# EAGLE design open-bldc-powermini (EAGLE 5.06)
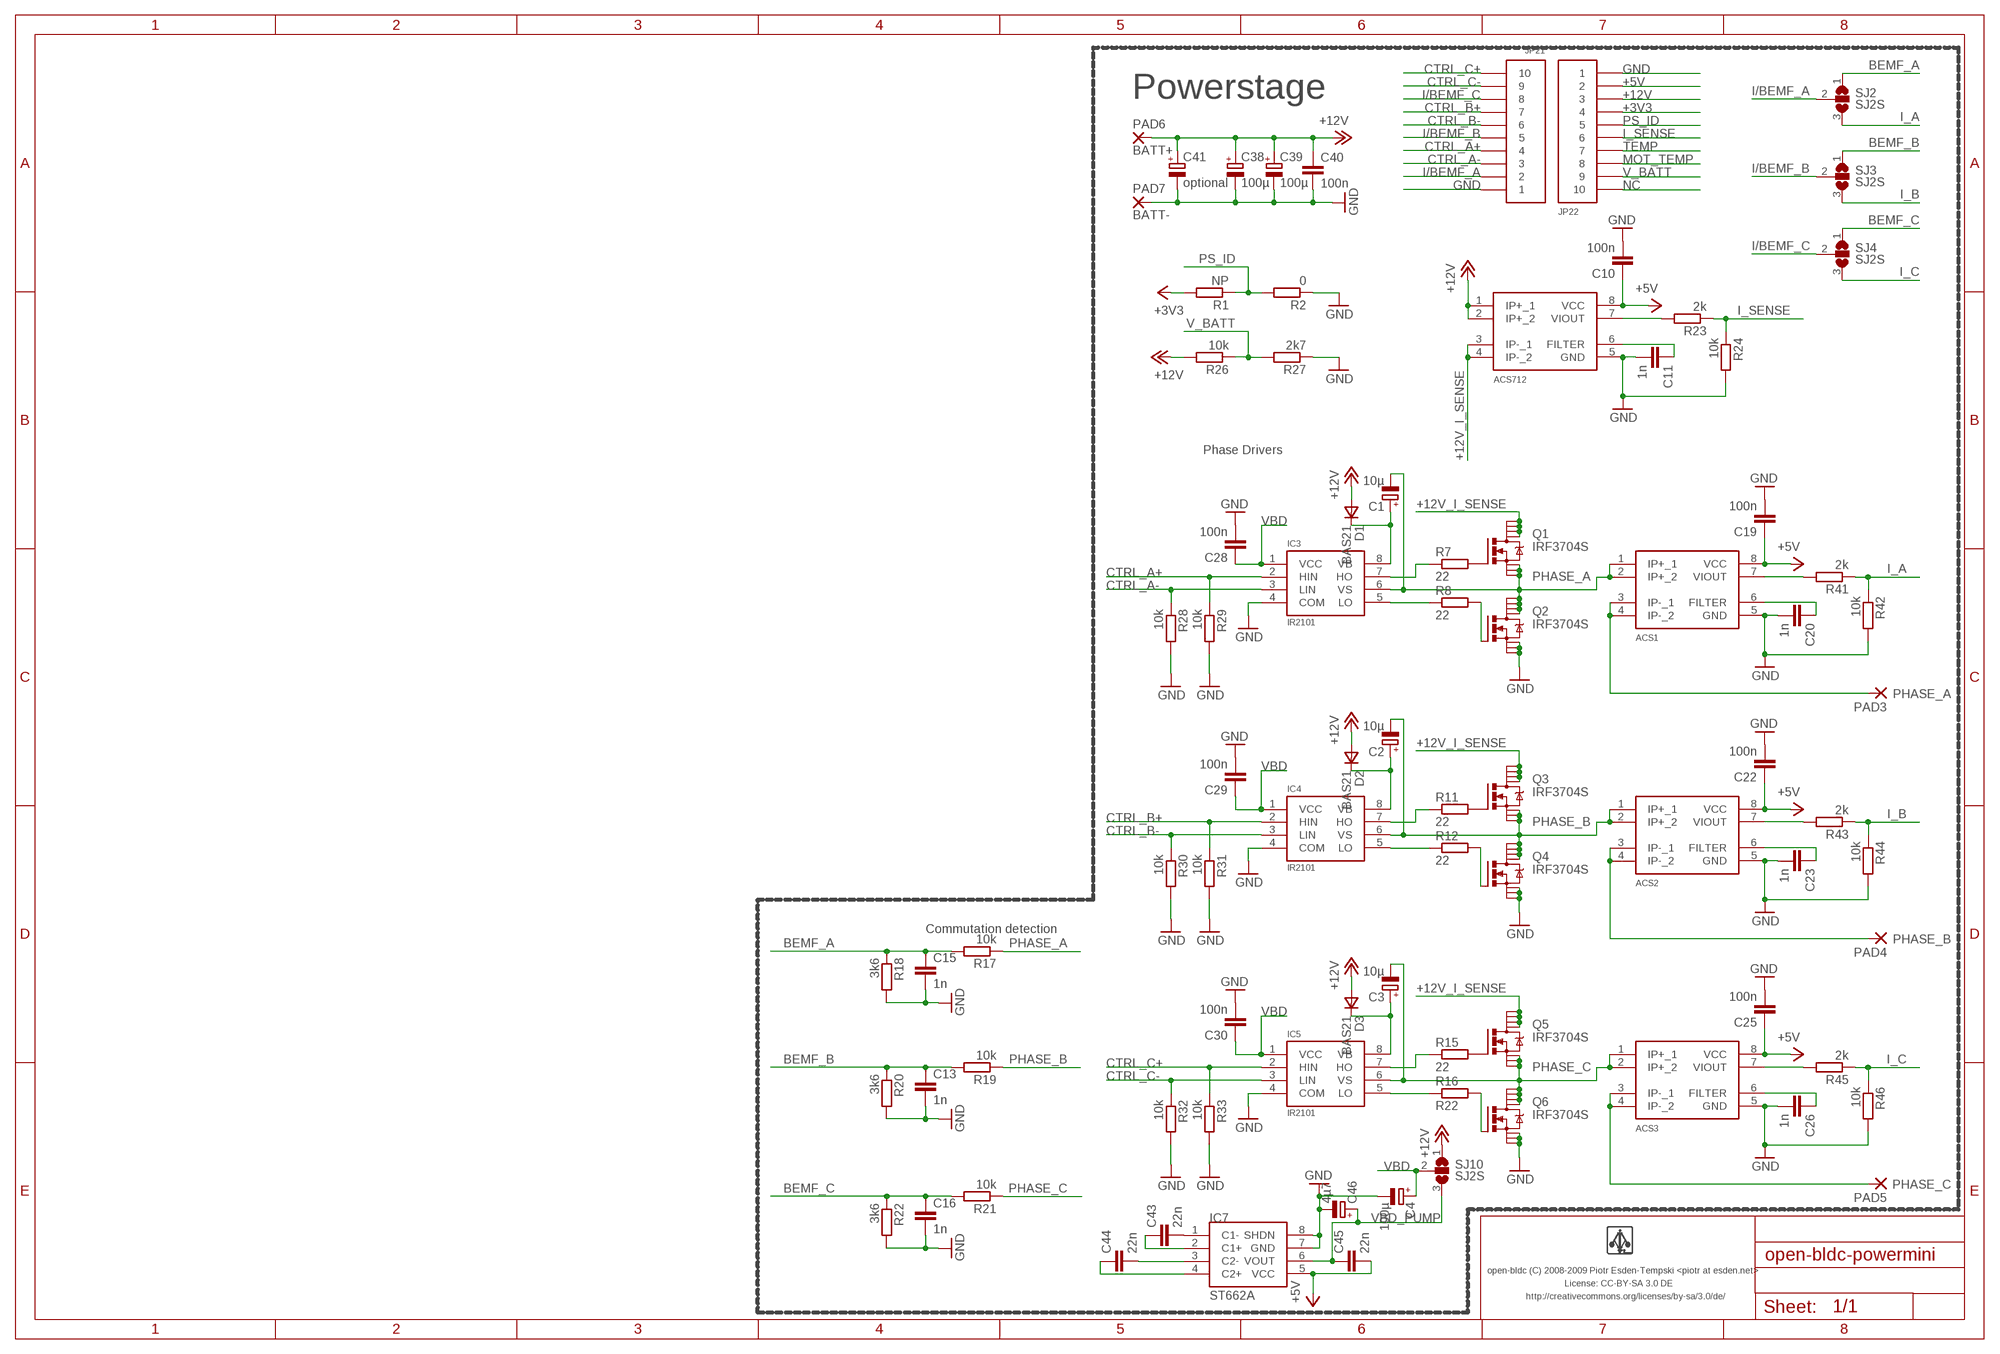
[diagram p0: schematic, sheet 1]

## Parts
ACS1  ACS712  [SO8]
ACS2  ACS712  [SO8]
ACS3  ACS712  [SO8]
ACS712  ACS712  [SO8]
C1  10µ  CPOL-EUA/3216-18R  [A/3216-18R]
C2  10µ  CPOL-EUA/3216-18R  [A/3216-18R]
C3  10µ  CPOL-EUA/3216-18R  [A/3216-18R]
C4  100µ  CPOL-EUD/7343-31R  [D/7343-31R]
C10  100n  C-EUC0603  [C0603]
C11  1n  C-EUC0603  [C0603]
C13  1n  C-EUC0603  [C0603]
C15  1n  C-EUC0603  [C0603]
C16  1n  C-EUC0603  [C0603]
C19  100n  C-EUC0603  [C0603]
C20  1n  C-EUC0603  [C0603]
C22  100n  C-EUC0603  [C0603]
C23  1n  C-EUC0603  [C0603]
C25  100n  C-EUC0603  [C0603]
C26  1n  C-EUC0603  [C0603]
C28  100n  C-EUC0603  [C0603]
C29  100n  C-EUC0603  [C0603]
C30  100n  C-EUC0603  [C0603]
C38  100µ  CPOL-EUD/7343-31R  [D/7343-31R]
C39  100µ  CPOL-EUD/7343-31R  [D/7343-31R]
C40  100n  C-EUC0603  [C0603]
C41  optional  CPOL-EUE5-6  [E5-6]
C43  22n  C-EUC0603  [C0603]
C44  22n  C-EUC0603  [C0603]
C45  22n  C-EUC0603  [C0603]
C46  4µ7  CPOL-EUA/3216-18R  [A/3216-18R]
D1  BAS21  VAR2SOT23  [SOT-23]
D2  BAS21  VAR2SOT23  [SOT-23]
D3  BAS21  VAR2SOT23  [SOT-23]
IC3  IR2101  [SO-8]
IC4  IR2101  [SO-8]
IC5  IR2101  [SO-8]
IC7  ST662A  [SO8]
JP21  PIN_HDR_1.27MM_10  PIN_HDR_1.27MM_10_SMT  [PIN_HDR_1.27MM_SMD_10]
JP22  PIN_HDR_1.27MM_10  PIN_HDR_1.27MM_10_SMT  [PIN_HDR_1.27MM_SMD_10]
PAD3  PHASE_A  SMD5  [SMD2,54-5,08]
PAD4  PHASE_B  SMD5  [SMD2,54-5,08]
PAD5  PHASE_C  SMD5  [SMD2,54-5,08]
PAD6  BATT+  SMD5  [SMD2,54-5,08]
PAD7  BATT-  SMD5  [SMD2,54-5,08]
Q1  IRF3704S  N-MOSFET-SO8S  [SO-08]
Q2  IRF3704S  N-MOSFET-SO8S  [SO-08]
Q3  IRF3704S  N-MOSFET-SO8S  [SO-08]
Q4  IRF3704S  N-MOSFET-SO8S  [SO-08]
Q5  IRF3704S  N-MOSFET-SO8S  [SO-08]
Q6  IRF3704S  N-MOSFET-SO8S  [SO-08]
R1  NP  R-EU_R0603  [R0603]
R2  0  R-EU_R0603  [R0603]
R7  22  R-EU_R0603  [R0603]
R8  22  R-EU_R0603  [R0603]
R11  22  R-EU_R0603  [R0603]
R12  22  R-EU_R0603  [R0603]
R15  22  R-EU_R0603  [R0603]
R16  R22  R-EU_R0603  [R0603]
R17  10k  R-EU_R0603  [R0603]
R18  3k6  R-EU_R0603  [R0603]
R19  10k  R-EU_R0603  [R0603]
R20  3k6  R-EU_R0603  [R0603]
R21  10k  R-EU_R0603  [R0603]
R22  3k6  R-EU_R0603  [R0603]
R23  2k  R-EU_R0603  [R0603]
R24  10k  R-EU_R0603  [R0603]
R26  10k  R-EU_R0603  [R0603]
R27  2k7  R-EU_R0603  [R0603]
R28  10k  R-EU_R0603  [R0603]
R29  10k  R-EU_R0603  [R0603]
R30  10k  R-EU_R0603  [R0603]
R31  10k  R-EU_R0603  [R0603]
R32  10k  R-EU_R0603  [R0603]
R33  10k  R-EU_R0603  [R0603]
R41  2k  R-EU_R0603  [R0603]
R42  10k  R-EU_R0603  [R0603]
R43  2k  R-EU_R0603  [R0603]
R44  10k  R-EU_R0603  [R0603]
R45  2k  R-EU_R0603  [R0603]
R46  10k  R-EU_R0603  [R0603]
SJ2  SJ2S  [SJ2S]
SJ3  SJ2S  [SJ2S]
SJ4  SJ2S  [SJ2S]
SJ10  SJ2S  [SJ2S]

## Nets
+3V3: JP22.4 R1.2
+5V: ACS1.8(VCC) ACS2.8(VCC) ACS3.8(VCC) ACS712.8(VCC) C10.1 C19.1 C22.1 C25.1 C45.2 IC7.5(VCC) JP22.2
+12V: ACS712.1(IP+_1) ACS712.2(IP+_2) C38.+ C39.+ C40.1 C41.+ D1.3(A) D2.3(A) D3.3(A) JP22.3 PAD6.1(P) R26.2 SJ10.1
+12V_I_SENSE: ACS712.3(IP-_1) ACS712.4(IP-_2) Q1.5(D) Q1.6(D) Q1.7(D) Q1.8(D) Q3.5(D) Q3.6(D) Q3.7(D) Q3.8(D) Q5.5(D) Q5.6(D) Q5.7(D) Q5.8(D)
BEMF_A: C15.1 R17.2 R18.1 SJ2.1
BEMF_B: C13.1 R19.2 R20.1 SJ3.1
BEMF_C: C16.1 R21.2 R22.1 SJ4.1
CTRL_A+: IC3.2(HIN) JP21.4 R29.1
CTRL_A-: IC3.3(LIN) JP21.3 R28.1
CTRL_B+: IC4.2(HIN) JP21.7 R31.1
CTRL_B-: IC4.3(LIN) JP21.6 R30.1
CTRL_C+: IC5.2(HIN) JP21.10 R33.1
CTRL_C-: IC5.3(LIN) JP21.9 R32.1
GND: ACS1.5(GND) ACS2.5(GND) ACS3.5(GND) ACS712.5(GND) C4.- C10.2 C11.2 C13.2 C15.2 C16.2 C19.2 C20.2 C22.2 C23.2 C25.2 C26.2 C28.2 C29.2 C30.2 C38.- C39.- C40.2 C41.- C46.- IC3.4(COM) IC4.4(COM) IC5.4(COM) IC7.7(GND) IC7.8(SHDN) JP21.1 JP22.1 PAD7.1(P) Q2.1(S) Q2.2(S) Q2.3(S) Q4.1(S) Q4.2(S) Q4.3(S) Q6.1(S) Q6.2(S) Q6.3(S) R2.1 R18.2 R20.2 R22.2 R24.2 R27.1 R28.2 R29.2 R30.2 R31.2 R32.2 R33.2 R42.2 R44.2 R46.2
I/BEMF_A: JP21.2 SJ2.2
I/BEMF_B: JP21.5 SJ3.2
I/BEMF_C: JP21.8 SJ4.2
I_A: R41.1 R42.1 SJ2.3
I_B: R43.1 R44.1 SJ3.3
I_C: R45.1 R46.1 SJ4.3
I_PHASE_A: ACS1.3(IP-_1) ACS1.4(IP-_2) PAD3.1(P)
I_PHASE_B: ACS2.3(IP-_1) ACS2.4(IP-_2) PAD4.1(P)
I_PHASE_C: ACS3.3(IP-_1) ACS3.4(IP-_2) PAD5.1(P)
I_SENSE: JP22.6 R23.1 R24.1
MOT_TEMP: JP22.8
N$1: IC4.7(HO) R11.1
N$2: IC3.7(HO) R7.1
N$6: ACS712.7(VIOUT) R23.2
N$7: IC3.5(LO) R8.1
N$11: Q1.4(G) R7.2
N$12: C1.+ D1.1(C) IC3.8(VB)
N$13: IC4.5(LO) R12.1
N$14: Q3.4(G) R11.2
N$15: Q5.4(G) R15.2
N$16: C2.+ D2.1(C) IC4.8(VB)
N$17: Q6.4(G) R16.2
N$18: IC5.7(HO) R15.1
N$19: IC5.5(LO) R16.1
N$21: C3.+ D3.1(C) IC5.8(VB)
N$23: ACS712.6(FILTER) C11.1
N$24: C43.2 IC7.1(C1-)
N$27: C44.2 IC7.3(C2-)
N$29: C43.1 IC7.2(C1+)
N$30: C44.1 IC7.4(C2+)
N$31: ACS1.6(FILTER) C20.1
N$32: ACS1.7(VIOUT) R41.2
N$34: ACS2.6(FILTER) C23.1
N$35: ACS2.7(VIOUT) R43.2
N$37: ACS3.6(FILTER) C26.1
N$38: ACS3.7(VIOUT) R45.2
N$43: Q2.4(G) R8.2
N$44: Q4.4(G) R12.2
NC: JP22.10
PHASE_A: ACS1.1(IP+_1) ACS1.2(IP+_2) C1.- IC3.6(VS) Q1.1(S) Q1.2(S) Q1.3(S) Q2.5(D) Q2.6(D) Q2.7(D) Q2.8(D) R17.1
PHASE_B: ACS2.1(IP+_1) ACS2.2(IP+_2) C2.- IC4.6(VS) Q3.1(S) Q3.2(S) Q3.3(S) Q4.5(D) Q4.6(D) Q4.7(D) Q4.8(D) R19.1
PHASE_C: ACS3.1(IP+_1) ACS3.2(IP+_2) C3.- IC5.6(VS) Q5.1(S) Q5.2(S) Q5.3(S) Q6.5(D) Q6.6(D) Q6.7(D) Q6.8(D) R21.1
PS_ID: JP22.5 R1.1 R2.2
TEMP: JP22.7
V_BATT: JP22.9 R26.1 R27.2
VBD: C4.+ C28.1 C29.1 C30.1 IC3.1(VCC) IC4.1(VCC) IC5.1(VCC) SJ10.2
VBD_PUMP: C45.1 C46.+ IC7.6(VOUT) SJ10.3

## Notes on the sheet
- Powerstage
- Phase Drivers
- Commutation detection
- open-bldc (C) 2008-2009 Piotr Esden-Tempski <piotr at esden.net>
- License: CC-BY-SA 3.0 DE
- http://creativecommons.org/licenses/by-sa/3.0/de/

## Library data of the parts
ACS1-ACS3 ACS712 = open-bldc:ACS712
C1-C4 C38 C39 C41 C46 = rcl:CPOL-EU: POLARIZED CAPACITOR, European symbol
C10 C11 C13 C15 C16 C19 C20 C22 C23 C25 C26 C28-C30 C40 C43-C45 = rcl:C-EU: CAPACITOR, European symbol
D1-D3 = zetex:VAR2SOT23: DIODE
IC3-IC5 = open-bldc:IR2101
IC7 = open-bldc:ST662A
JP21 JP22 = open-bldc:PIN_HDR_1.27MM_10
PAD3-PAD7 = wirepad:SMD5: SMD PAD
Q1-Q6 = my-transistor-power:N-MOSFET-SO8: N-Channel MOSFET Example: FDS7760A; N-Channel Logic Level PowerTrench® MOSFET FDS2572; N-Channel UltraFET® Trench MOSFET Source: www.fairchildsemi.com
R1 R2 R7 R8 R11 R12 R15-R24 R26-R33 R41-R46 = rcl:R-EU_: RESISTOR, European symbol
SJ2-SJ4 SJ10 = open-bldc:SJ2S

## Net classes
0 default: width 0.152 mm, drill 0.305 mm, clearance 0.152 mm

## Board
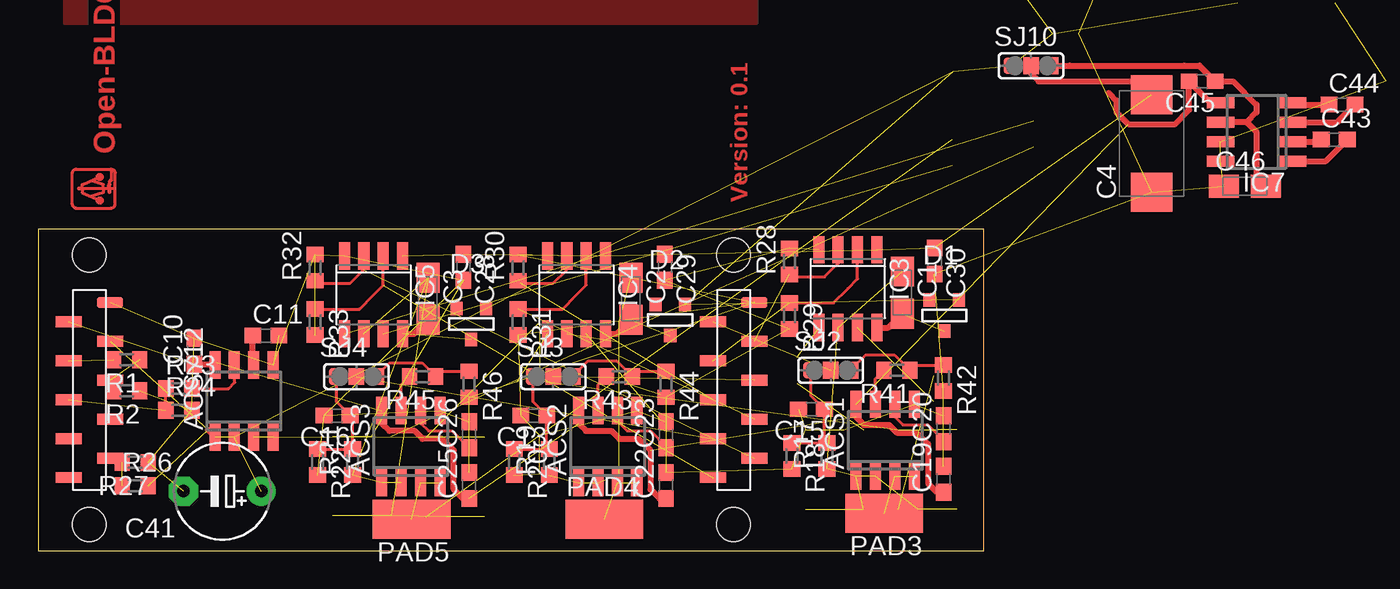
[diagram p1: board, top side]
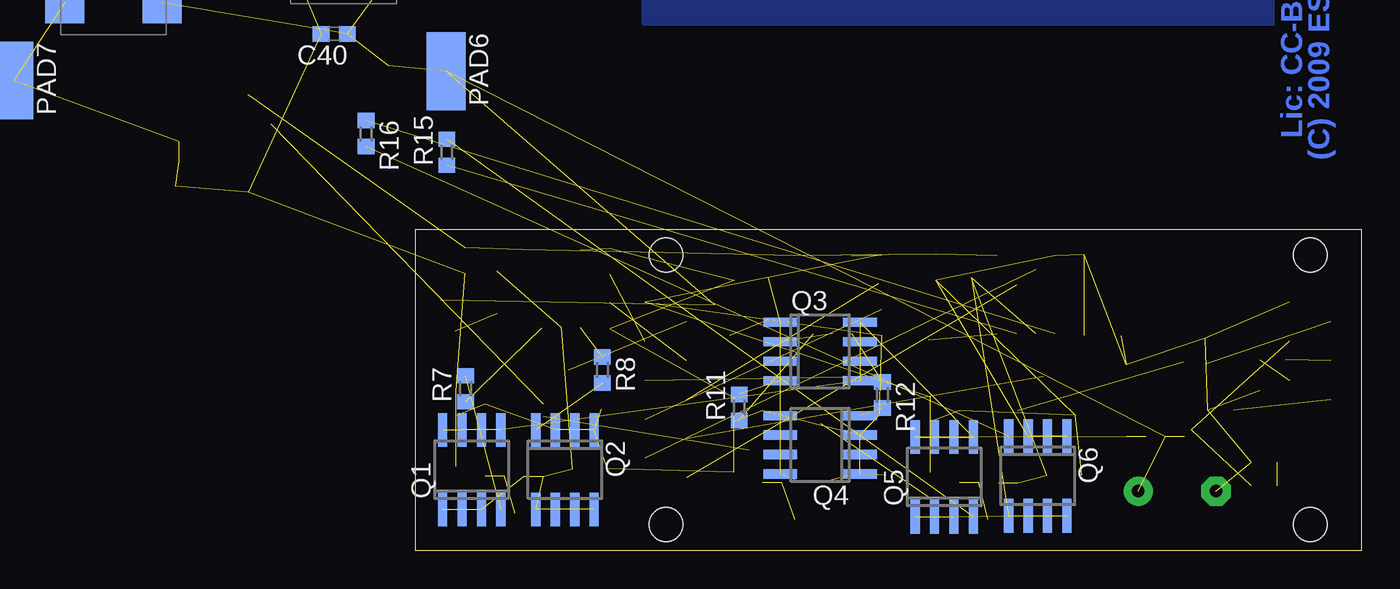
[diagram p2: board, bottom side, seen from below]

Size 61.8 x 21 mm. Coordinates in mm from the lower left corner, seen from the top.
Outline: 61.8,0 61.8,21 0,21 0,0 61.8,0
Copper layers (1*16): Top 0.035mm / dielectric 1.5mm / Bottom 0.035mm
Design rules "open-bldc *": minimum track width 8mil, minimum drill 0.4mm, track to track 8mil, track to pad 8mil, pad to pad 8mil, via to via 8mil, smd to smd 8mil, copper to edge 40mil, drill to drill 8mil, minimum pad ring 8mil, minimum via ring 8mil, stop-mask expansion 4mil, vias tented up to drill 0mil, thermal gap 10mil
Holes 2.2 mm at 45.43,1.7 3.33,1.7 3.33,19.3 45.43,19.3
tKeepout: 22 lines

### Footprints (pad centres in the part's own frame; a part is rotated, then mirrored left to right if it is on the bottom)
SO8 = smd 0.72 x 1.78: 1 -1.905,-2.35; 2 -0.635,-2.35; 3 0.635,-2.35; 4 1.905,-2.35; 5 1.905,2.35; 6 0.635,2.35; 7 -0.635,2.35; 8 -1.905,2.35
A/3216-18R = smd 1.95 x 1.5: + 1.375,0; - -1.375,0
D/7343-31R = smd 2.55 x 2.7: + 3.175,0; - -3.175,0
C0603 = smd 1.1 x 1: 1 -0.85,0; 2 0.85,0
E5-6 = drill 0.813 pad 1.905 round: + -2.54,0 | drill 0.813 pad 1.905 octagon: - 2.54,0
SOT-23 = smd 0.787 x 0.889: 1 0.025,-1.016; 2 -0.94,1.016; 3 0.991,1.016
SO-8 = smd 0.72 x 1.78: 1 -1.905,-2.543; 2 -0.635,-2.543; 3 0.635,-2.543; 4 1.905,-2.543; 5 1.905,2.543; 6 0.635,2.543; 7 -0.635,2.543; 8 -1.905,2.543
PIN_HDR_1.27MM_SMD_10 = smd 1.702 x 0.711: 1 -1.346,0; 2 1.346,1.27; 3 -1.346,2.54; 4 1.346,3.81; 5 -1.346,5.08; 6 1.346,6.35; 7 -1.346,7.62; 8 1.346,8.89; 9 -1.346,10.16; 10 1.346,11.43
SMD2,54-5,08 = smd 2.54 x 5.08: 1 0,0
SO-08 = smd 0.6 x 2.2: 1 -1.905,-2.6; 2 -0.635,-2.6; 3 0.635,-2.6; 4 1.905,-2.6; 5 1.905,2.6; 6 0.635,2.6; 7 -0.635,2.6; 8 -1.905,2.6
R0603 = smd 1 x 1.1: 1 -0.85,0; 2 0.85,0
SJ2S = smd 1 x 1.1: 1 -1.3,0; 2 0,0; 3 1.3,0

### Placement (x,y rotation side)
ACS1  55.33,7.2 0 top
ACS2  37.2,6.79 0 top
ACS3  24.35,6.79 0 top
ACS712  13.45,9.77 0 top
C1  56.45,16.85 270 top
C2  38.72,16.44 270 top
C3  25.46,16.44 270 top
C4  72.73,26.58 90 top  (outside the outline)
C10  10.2,13.02 90 top
C11  14.87,14.04 0 top
C13  32.37,8.82 180 top
C15  50.51,9.23 180 top
C16  19.52,8.82 180 top
C19  59.14,4.66 90 top
C20  59.14,7.96 90 top
C22  41.01,4.25 90 top
C23  41.01,7.55 90 top
C25  28.16,4.25 90 top
C26  28.16,7.55 90 top
C28  27.77,18.51 270 top
C29  40.93,18.51 270 top
C30  58.56,18.91 270 top
C38  81.52,35.78 0 bottom  (outside the outline)
C39  66.48,37.81 0 bottom  (outside the outline)
C40  67.09,33.75 180 bottom  (outside the outline)
C41  12.03,3.88 180 top
C43  84.67,26.84 0 top  (outside the outline)
C44  85.18,29.12 0 top  (outside the outline)
C45  76.03,30.65 180 top  (outside the outline)
C46  78.83,23.79 0 top  (outside the outline)
D1  59.17,15.35 0 top
D2  41.26,15.05 0 top
D3  28.26,14.8 0 top
IC3  52.9,17.1 180 top
IC4  35.17,16.7 180 top
IC5  21.91,16.7 180 top
IC7  79.59,27.35 90 top  (outside the outline)
JP21  45.44,16.2 180 top
JP22  3.34,16.2 180 top
PAD3  55.27,2.44 90 top
PAD4  36.98,2.03 270 top
PAD5  24.38,2.03 90 top
PAD6  59.78,31.31 180 bottom  (outside the outline)
PAD7  88.02,30.7 180 bottom  (outside the outline)
Q1  58.12,5.28 0 bottom
Q2  52.02,5.28 180 bottom
Q3  35.36,13 270 bottom
Q4  35.36,6.91 90 bottom
Q5  27.24,4.81 0 bottom
Q6  21.13,4.88 180 bottom
R1  5.78,12.46 180 top
R2  5.78,10.43 180 top
R7  58.52,10.57 90 bottom
R8  49.58,11.79 270 bottom
R11  40.64,9.35 90 bottom
R12  31.29,10.16 270 bottom
R15  59.74,26.01 90 bottom  (outside the outline)
R16  65.02,27.23 270 bottom  (outside the outline)
R17  51.52,6.18 90 top
R18  49.24,6.18 270 top
R19  33.39,5.78 90 top
R20  31.1,5.78 270 top
R21  20.54,5.78 90 top
R22  18.25,5.78 270 top
R23  9.18,10.58 0 top
R24  9.18,9.16 0 top
R26  6.34,4.23 0 top
R27  6.34,5.76 180 top
R28  49.09,18.88 90 top
R29  49.09,15.33 270 top
R30  31.36,18.48 90 top
R31  31.36,14.92 270 top
R32  18.1,18.48 90 top
R33  18.1,14.92 270 top
R41  56.1,11.77 180 top
R42  59.14,11.26 270 top
R43  37.96,11.36 180 top
R44  41.01,10.86 270 top
R45  25.11,11.36 180 top
R46  28.16,10.86 270 top
SJ2  51.78,11.77 0 top
SJ3  33.64,11.36 0 top
SJ4  20.79,11.36 0 top
SJ10  64.86,31.66 0 top  (outside the outline)

### Tracks (layer width: path | path; a pad name or v marks a point on that pad's centre or on a via)
+3V3  (1 unrouted)
+5V  (5 unrouted)
  Top 0.406: ACS2.8 35.29,8.29 35.78,7.81 37.45,7.81 37.96,7.3 39.23,7.3 39.99,6.54 39.99,4 40.59,3.4 40.67,3.4 | ACS1.8 53.43,8.72 53.94,8.21 55.59,8.21 56.1,7.71 57.37,7.71 58.13,6.94 58.13,4.4 58.72,3.81 58.8,3.81 | ACS3.8 22.44,8.32 22.95,7.81 24.6,7.81 25.11,7.3 26.38,7.3 27.14,6.54 27.14,4 27.74,3.4 | 69.94,29.89 70.45,29.38 70.45,28.62 71.21,27.85 74.26,27.85 75.18,28.78 C45.2 76.58,29.25 IC7.5 | 58.8,3.81 C19.1 58.8,3.81 | 40.67,3.4 C22.1 40.67,3.4 | 40.67,3.4 40.75,3.31 | 58.8,3.81 58.89,3.81 | C25.1 27.74,3.4 | 27.74,3.4 27.9,3.24 | C10.1 11.49,12.17 | 11.49,12.17 ACS712.8 | 11.49,12.17 11.62,12.3 11.6,12.32
+12V  (12 unrouted)
  Top 0.406: ACS712.1 11.09,7.87
+12V_I_SENSE  (13 unrouted)
BEMF_A
  Top 0.203: SJ2.1 50.48,10.11 C15.1 51.36,7.2 R17.2 R18.1
BEMF_B
  Top 0.203: SJ3.1 32.34,9.7 C13.1 33.22,6.79 R19.2 R20.1
BEMF_C
  Top 0.203: R22.1 R21.2 20.54,8.66 C16.1 19.49,9.7 SJ4.1
CTRL_A+  (1 unrouted)
  Top 0.203: R29.1 51.97,16.18 52.9,17.1 53.53,17.74 IC3.2
CTRL_A-  (1 unrouted)
  Top 0.203: R28.1 49.25,17.87 51.37,17.87 52.26,18.75 IC3.3
CTRL_B+  (1 unrouted)
  Top 0.203: R31.1 34.24,15.77 35.17,16.7 35.8,17.33 IC4.2
CTRL_B-  (1 unrouted)
  Top 0.203: R30.1 31.52,17.46 33.64,17.46 34.53,18.35 IC4.3
CTRL_C+  (1 unrouted)
  Top 0.203: R33.1 20.98,15.77 21.91,16.7 22.54,17.33 IC5.2
CTRL_C-  (1 unrouted)
  Top 0.203: R32.1 18.26,17.46 20.38,17.46 21.27,18.35 IC5.3
GND  (55 unrouted)
  pour Bottom (isolate 0.406, rank 2): 46.93,34.41 1.71,34.41 1.71,43.45 46.93,43.45
  pour Top (isolate 0.305, rank 2): 46.93,34.41 1.71,34.41 1.71,43.45 46.93,43.45
I/BEMF_A  (1 unrouted)
I/BEMF_B  (1 unrouted)
I/BEMF_C  (1 unrouted)
I_A
  Top 0.203: R42.1 57.29,12.11 R41.1 55.93,12.79 54.06,12.79 53.08,11.8 SJ2.3
I_B
  Top 0.203: R44.1 39.15,11.71 R43.1 37.79,12.38 35.93,12.38 34.94,11.39 SJ3.3
I_C
  Top 0.203: R46.1 26.3,11.71 R45.1 25.07,12.25 22.95,12.25 22.09,11.39 SJ4.3
I_PHASE_A  (2 unrouted)
I_PHASE_B  (2 unrouted)
I_PHASE_C  (2 unrouted)
I_SENSE  (1 unrouted)
  Top 0.203: R24.1 R23.1
LOGO
  Top 0.203: 5.02,23.64 5.02,22.62 arc-90 4.76,22.37 2.48,22.37 arc-90 2.22,22.62 2.22,24.65 arc-90 2.48,24.91 4.76,24.91 | 5.02,23.64 5.02,24.65 arc90 4.76,24.91 | 4,22.88 2.86,23.38 2.86,23.64 | 2.86,23.64 2.86,23.89 4,24.4 | 3.49,23.13 4.25,23.38 4.25,23.64 | 4.25,23.64 4.25,23.89 3.47,24.14 | 4.76,24.91 4.76,24.14 4.64,24.14 4.64,23.89 4.66,23.64 4.64,23.64 | 4.25,23.64 2.86,23.64 | 4.64,23.64 4.25,23.64 | 5.02,23.64 4.64,23.64 | 2.86,23.64 2.68,23.64
  Top 0.254: 4.64,23.89 4.64,23.64 4.64,23.41 | 2.68,23.64 2.65,23.64
  Top 0.508: 4,24.4 4.03,24.4 | 4,22.88 4.03,22.88
N$1  (1 unrouted)
N$2  (1 unrouted)
N$6
  Top 0.203: 13.01,12.31 ACS712.7 12.84,12.09 12.84,10.99 12.43,10.58 R23.2
N$7  (1 unrouted)
N$11  (1 unrouted)
N$12  (1 unrouted)
  Top 0.406: C1.+ 55.54,14.56 IC3.8
N$13  (1 unrouted)
N$14  (1 unrouted)
N$15  (1 unrouted)
N$16  (1 unrouted)
  Top 0.406: C2.+ 37.81,14.15 IC4.8
N$17  (1 unrouted)
N$18  (1 unrouted)
N$19  (1 unrouted)
N$21  (1 unrouted)
  Top 0.406: C3.+ 24.55,14.15 IC5.8
N$23
  Top 0.406: C11.1 14.02,12.18 ACS712.6
N$24
  Top 0.406: C43.2 84.12,25.44 IC7.1
N$27
  Top 0.406: C44.2 84.89,27.98 IC7.3
N$29
  Top 0.406: C43.1 83.69,26.71 IC7.2
N$30
  Top 0.406: C44.1 82.07,29.12 IC7.4
N$31
  Top 0.203: C20.1 59.14,7.2 58.13,8.21 56.48,8.21 55.97,8.72 ACS1.6
N$32
  Top 0.203: R41.2 54.7,11.22 ACS1.7
N$34
  Top 0.203: C23.1 41.01,6.79 39.99,7.81 38.47,7.81 37.96,8.32 37.96,9.02 ACS2.6
N$35
  Top 0.203: R43.2 36.56,10.82 ACS2.7
N$37
  Top 0.203: C26.1 27.05,7.81 25.49,7.81 24.98,8.32 ACS3.6
N$38
  Top 0.203: ACS3.7 23.71,10.82 R45.2
N$43  (1 unrouted)
N$44  (1 unrouted)
PHASE_A  (11 unrouted)
PHASE_B  (11 unrouted)
PHASE_C  (11 unrouted)
PS_ID  (1 unrouted)
  Top 0.203: JP22.5 4.24,11.12 R2.2
V_BATT  (1 unrouted)
  Top 0.203: R27.2 5.2,6.04 JP22.9
VBD  (6 unrouted)
  Top 0.406: C4.+ 71.84,30.65 65.37,30.65 64.86,31.16 SJ10.2
VBD_PUMP
  Top 0.406: C46.+ 79.59,24.4 79.59,27.35 78.96,27.98 | 78.96,27.98 IC7.6 78.96,27.98 | 78.96,27.98 79.59,28.62 79.59,29.12 78.07,30.65 C45.1 75.87,31.66 74.85,31.66 67.4,31.66 SJ10.3

### Text on the board
Top: Open-BLDC.org | Version: 0.1
Bottom: (C) 2009 ESDEN | Lic: CC-BY-SA
tKeepout: Open-BLDC.org | Version: 0.1
bKeepout: (C) 2009 ESDEN | Lic: CC-BY-SA